# Altium schematic sheet Sensors.SchDoc
size A4; Organization: Rotronic AG; Address1: Grindelstrasse 6; Address2: 8303 Bassersdorf; Address3: Switzerland; DocumentNumber: 5; SheetNumber: 5; SheetTotal: 10; Web_Address: www.rotronic.ch; E_Mail_Address: *@rotronic.ch; Fon: +41 (0)44 838 11 11; Fax: +41 (0)44 836 44 24
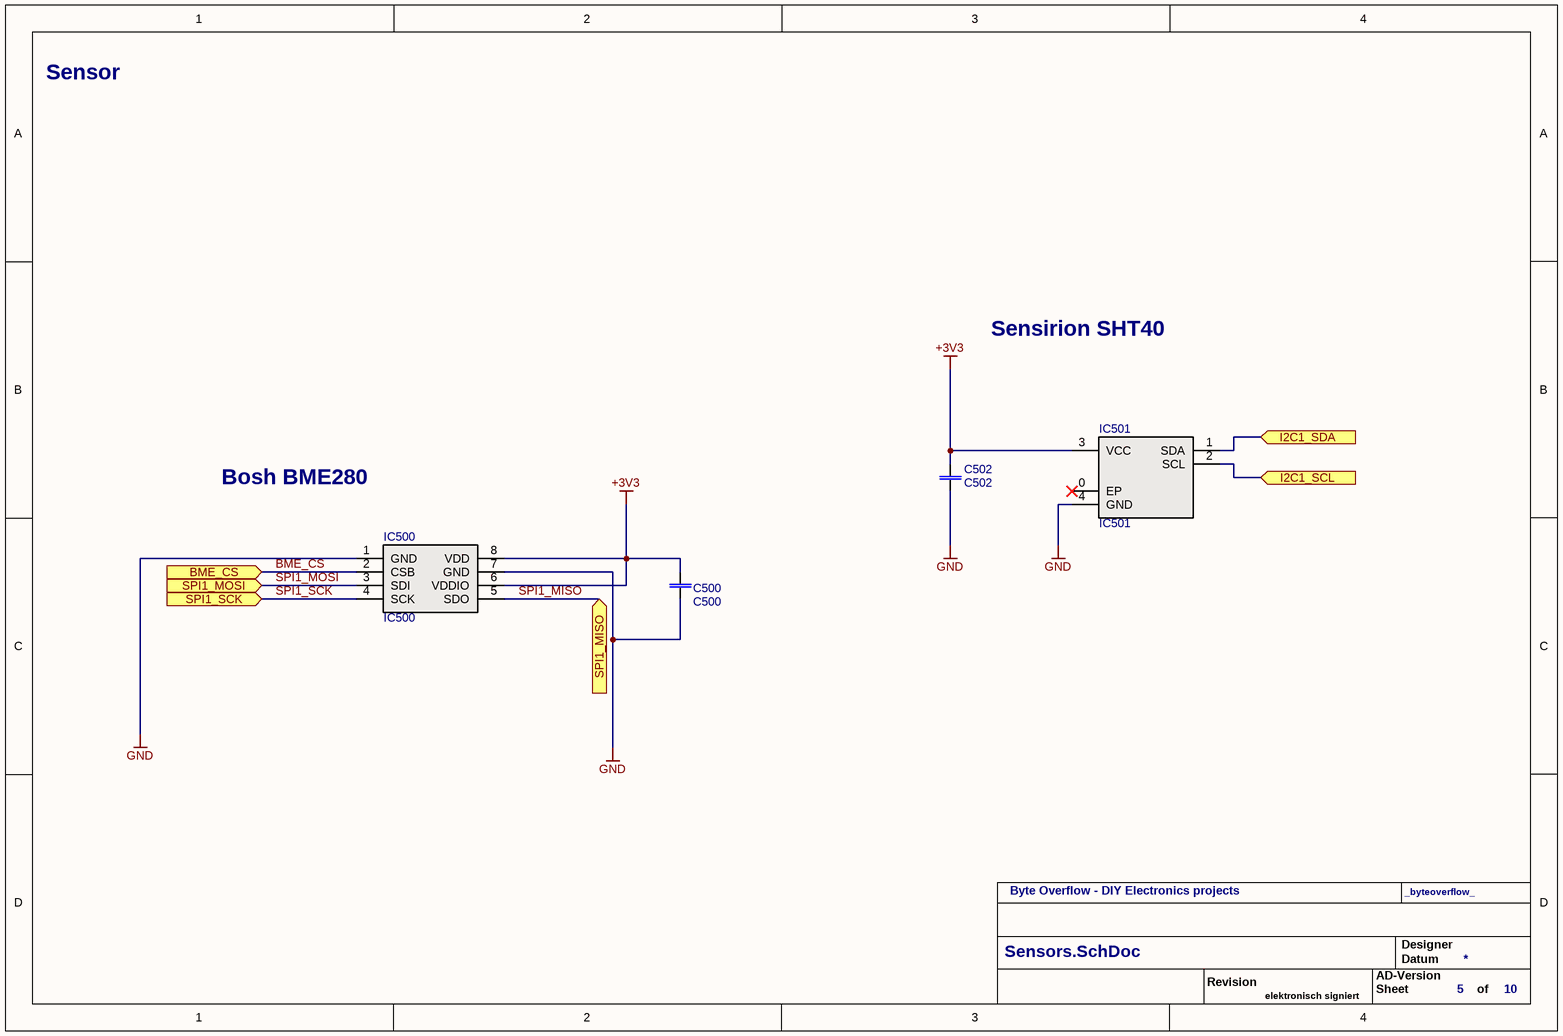
[diagram p0: Sensors.SchDoc]

## Parts
C500  C500  [0603-1608]
C502  C502  [0603-1608]
IC500  IC500  [LGA-8 2.5x2.5x0.95]
IC501  IC501  [XDCR_SHT40-AD1B-R2]

## Ports
BME_CS (in), I2C1_SCL (in), I2C1_SDA (in), SPI1_MISO (in), SPI1_MOSI (in), SPI1_SCK (in)

## Nets
+3V3: C500.1 C502.1 IC500.6(VDDIO) IC500.8(VDD) IC501.3(VCC)
GND: C500.2 C502.2 IC500.1(GND) IC500.7(GND) IC501.4(GND)
BME_CS: IC500.2(CSB) ; port BME_CS
I2C1_SCL: IC501.2(SCL) ; port I2C1_SCL
I2C1_SDA: IC501.1(SDA) ; port I2C1_SDA
SPI1_MISO: IC500.5(SDO) ; port SPI1_MISO
SPI1_MOSI: IC500.3(SDI) ; port SPI1_MOSI
SPI1_SCK: IC500.4(SCK) ; port SPI1_SCK

Not connected (* = marked no-connect by the designer): IC501 0(EP)*

## Notes on the sheet
- Sensor
- Sensirion SHT40
- Bosh BME280
- Byte Overflow - DIY Electronics projects
- _byteoverflow_
- Revision
- AD-Version
- Designer
- Datum
- elektronisch signiert
- Sheet
- of

## Library data of the parts
C500 C502 = F0161: Capacitor; Part-Number: 63.0104.1450; Manufacturer: KEMET; Manufacturer Part Number: C0603C104K5RACTU; ID: F0161; Operating Range: -55°C to +125°C; Note: 100nF 50V X7R 10% Kemet C0603C104K5RACTU; Specification: 05.09.2013 OPT; Value: 100nF 50V; Designator: C 100nF 50V X7R; Component Type: Standard; Status: Active; Availability Date: 15.11.2016 OPT; RoHS compliant: Yes; Flammability: n.a.; Pin Count: 2; Price 100: 0.007; Price 1000: 0.007; Price Date: 02.12.2019 Pro Alpha; Changed: 05.09.2013 OPT; Price: 0.01; Supplier 1: Digi-Key; Supplier Part Number 1: 399-5089-1-ND; Part Status: Active; RoHS: RoHS Compliant; ComponentLink1Description: Datasheet; ComponentLink1URL: http://www.kemet.com/kemet/web/homepage/kechome.nsf/vapubfiles/KEM_C1002_X7R_SMD.pdf/$file/KEM_C1002_X7R_SMD.pdf
IC500 = E0109: Sensor; Part-Number: 61.0280.0499; Manufacturer: Bosch Sensortec; Designator: BME280; ID: E0109; Operating Range: -40°C to +85°C; Note: Bosch BME280 Digital Pressure/Humidity/Temperature Sensor; Specification: 05.04.2016 ENP; Value: BME280; Component Type: Standard; ComponentLink1Description: Datasheet; ComponentLink1URL: https://ae-bst.resource.bosch.com/media/_tech/media/datasheets/BST-BME280_DS001-11.pdf; Status: Active; Availability Date: 15.11.2016 OPT; RoHS compliant: Yes; Flammability: n.a.; Pin Count: 8; Price 100: 6.18; Price 1000: 5.35; Price Date: 02.12.2019 Pro Alpha; Changed: 05.04.2016 ENP; Price: 3.595; Supplier 1: Digi-Key; Supplier Part Number 1: 828-1063-1-ND; Manufacturer Part Number: BME280; Part Status: Active; RoHS: RoHS Compliant
IC501 = E0147: Sensor; Part-Number: 00.0000.0000; Manufacturer: Sensirion; Designator: SHT40-AD1B-R2; ID: E0147; Operating Range: -40°C to +85°C; Note: Feuchtigkeitssensoren für Plattenmontage RH/ T Sensor; Specification: 02.04.2021 PEK; Value: SHT40-AD1B-R2; Component Type: Standard; ComponentLink1Description: Datasheet; ComponentLink1URL: https://www.mouser.ch/datasheet/2/682/Datasheet_SHT4xA-3002605.pdf; Status: Active; Availability Date: 02.04.2021 PEK; RoHS compliant: Yes; Flammability: n.a; Pin Count: 5; Price 100: 1.68; Price 1000: 1.33; Price Date: 02.04.2021 PEK; Changed: 02.04.2021 PEK; Price: 2.87; Supplier 1: Mouser; Supplier Part Number 1: 403-SHT40-AD1B-R2; Manufacturer Part Number: SHT40-AD1B-R2; Part Status: Active; RoHS: RoHS Compliant